# Altium project SysP18_Team10.PrjPcb
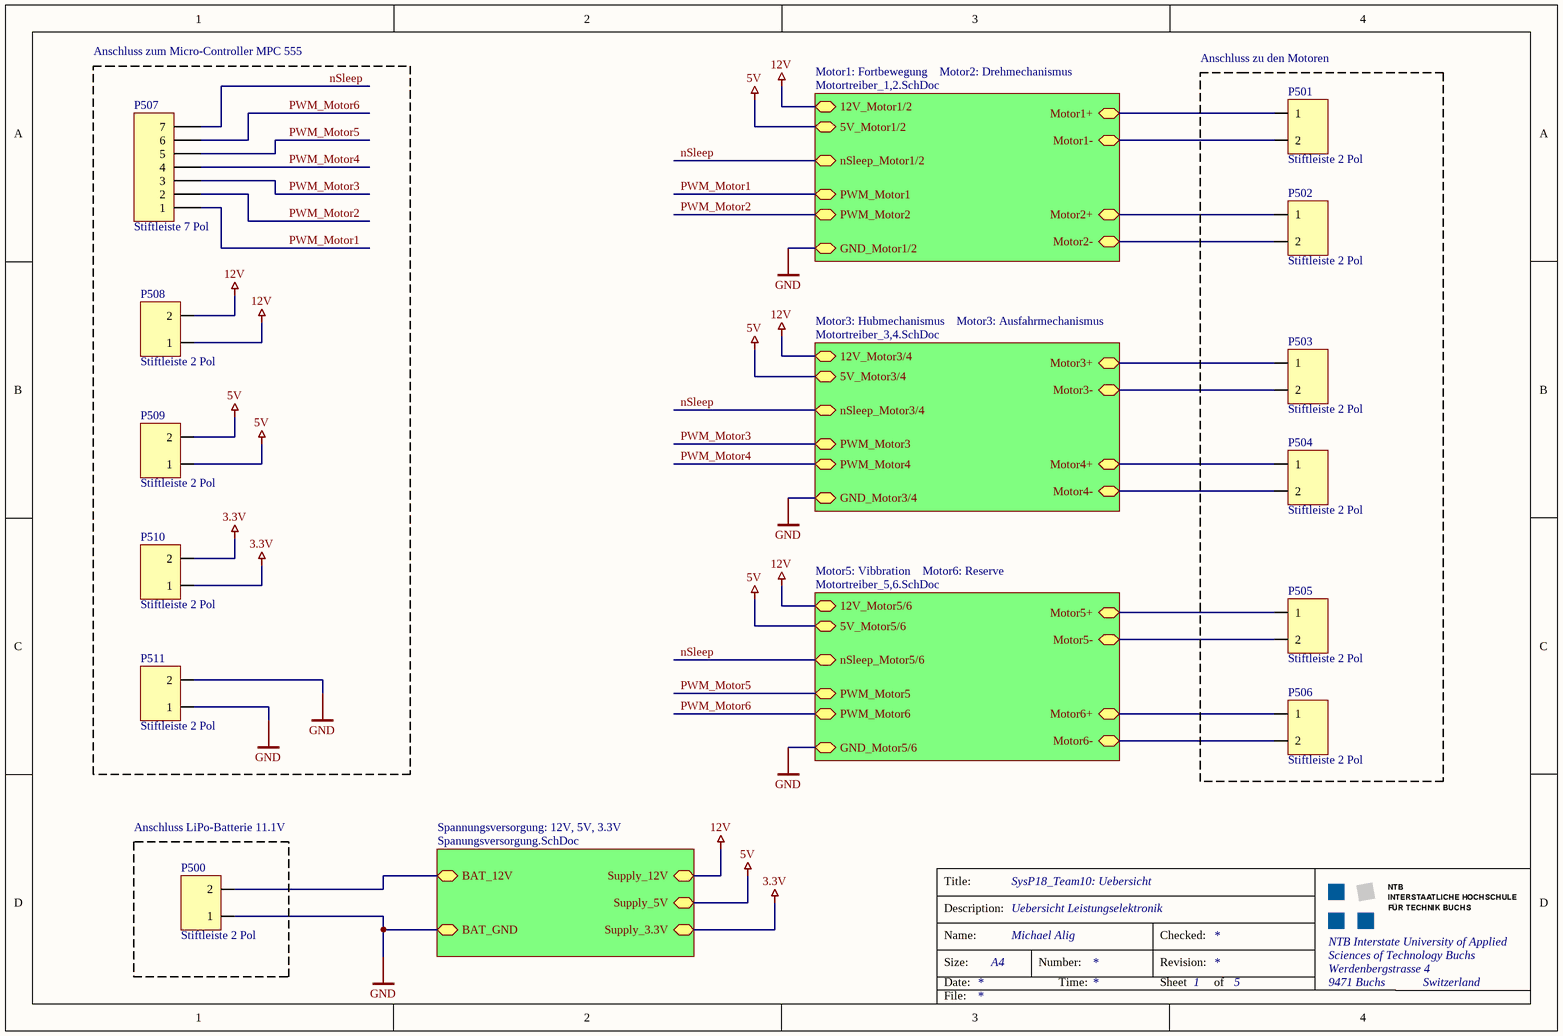
[diagram p0: Uebersicht.SchDoc]
3 sheets, 43 parts. Net scope: hierarchical (ports join the sheet entries above them; power ports are global).
Board file: PCB.PcbDoc
Sheets:
  Uebersicht.SchDoc
    Spannungsversorgung: 12V, 5V, 3.3V = Spanungsversorgung.SchDoc
    Motor1: Fortbewegung    Motor2: Drehmechanismus = Motortreiber_1,2.SchDoc

## Sheet Uebersicht.SchDoc: SysP18_Team10: Uebersicht
size A4; Author: Michael Alig; CompanyName: NTB; Organization: NTB Interstate University of Applied; Address1: Werdenbergstrasse 4; Address3: 9471 Buchs; Address4: Switzerland; SheetNumber: 1; SheetTotal: 5; Organization1: Sciences of Technology Buchs; Size: A4; ShortDescription: Uebersicht Leistungselektronik

### Parts
P500  Stiftleiste 2 Pol  [2Pin Header 2.54mm]
P501  Stiftleiste 2 Pol  [2Pin Header 2.54mm]
P502  Stiftleiste 2 Pol  [2Pin Header 2.54mm]
P503  Stiftleiste 2 Pol  [2Pin Header 2.54mm]
P504  Stiftleiste 2 Pol  [2Pin Header 2.54mm]
P505  Stiftleiste 2 Pol  [2Pin Header 2.54mm]
P506  Stiftleiste 2 Pol  [2Pin Header 2.54mm]
P507  Stiftleiste 7 Pol  [GEN_HEADER-2.54mm_7_H]
P508  Stiftleiste 2 Pol  [2Pin Header 2.54mm]
P509  Stiftleiste 2 Pol  [2Pin Header 2.54mm]
P510  Stiftleiste 2 Pol  [2Pin Header 2.54mm]
P511  Stiftleiste 2 Pol  [2Pin Header 2.54mm]

### Blocks framed on the sheet
Anschluss zum Micro-Controller MPC 555: P507-P511
Anschluss zu den Motoren: P501-P506
Anschluss LiPo-Batterie 11.1V: P500

### Sub-sheets
Motor1: Fortbewegung    Motor2: Drehmechanismus = Motortreiber_1,2.SchDoc: nSleep_Motor1/2, PWM_Motor2, Motor1+, Motor1-, PWM_Motor1, Motor2+, Motor2-, 12V_Motor1/2, GND_Motor1/2, 5V_Motor1/2
Motor3: Hubmechanismus    Motor3: Ausfahrmechanismus = Motortreiber_3,4.SchDoc (file not in this document): nSleep_Motor3/4, PWM_Motor4, Motor3+, Motor3-, PWM_Motor3, Motor4+, Motor4-, 12V_Motor3/4, GND_Motor3/4, 5V_Motor3/4
Motor5: Vibbration    Motor6: Reserve = Motortreiber_5,6.SchDoc (file not in this document): nSleep_Motor5/6, PWM_Motor6, Motor5+, Motor5-, PWM_Motor5, Motor6+, Motor6-, 12V_Motor5/6, GND_Motor5/6, 5V_Motor5/6
Spannungsversorgung: 12V, 5V, 3.3V = Spanungsversorgung.SchDoc: BAT_12V, BAT_GND, Supply_5V, Supply_3.3V, Supply_12V

### Nets
3.3V: P510.1 P510.2 ; sheet Spannungsversorgung: 12V, 5V, 3.3V/Supply_3.3V
5V: P509.1 P509.2 ; sheet Spannungsversorgung: 12V, 5V, 3.3V/Supply_5V, sheet Motor1: Fortbewegung    Motor2: Drehmechanismus/5V_Motor1/2, sheet Motor3: Hubmechanismus    Motor3: Ausfahrmechanismus/5V_Motor3/4, sheet Motor5: Vibbration    Motor6: Reserve/5V_Motor5/6
12V: P508.1 P508.2 ; sheet Spannungsversorgung: 12V, 5V, 3.3V/Supply_12V, sheet Motor1: Fortbewegung    Motor2: Drehmechanismus/12V_Motor1/2, sheet Motor3: Hubmechanismus    Motor3: Ausfahrmechanismus/12V_Motor3/4, sheet Motor5: Vibbration    Motor6: Reserve/12V_Motor5/6
GND: P500.1 P511.1 P511.2 ; sheet Spannungsversorgung: 12V, 5V, 3.3V/BAT_GND, sheet Motor1: Fortbewegung    Motor2: Drehmechanismus/GND_Motor1/2, sheet Motor3: Hubmechanismus    Motor3: Ausfahrmechanismus/GND_Motor3/4, sheet Motor5: Vibbration    Motor6: Reserve/GND_Motor5/6
nSleep: P507.7 ; sheet Motor1: Fortbewegung    Motor2: Drehmechanismus/nSleep_Motor1/2, sheet Motor3: Hubmechanismus    Motor3: Ausfahrmechanismus/nSleep_Motor3/4, sheet Motor5: Vibbration    Motor6: Reserve/nSleep_Motor5/6
PWM_Motor1: P507.1 ; sheet Motor1: Fortbewegung    Motor2: Drehmechanismus/PWM_Motor1
PWM_Motor2: P507.2 ; sheet Motor1: Fortbewegung    Motor2: Drehmechanismus/PWM_Motor2
PWM_Motor3: P507.3 ; sheet Motor3: Hubmechanismus    Motor3: Ausfahrmechanismus/PWM_Motor3
PWM_Motor4: P507.4 ; sheet Motor3: Hubmechanismus    Motor3: Ausfahrmechanismus/PWM_Motor4
PWM_Motor5: P507.5 ; sheet Motor5: Vibbration    Motor6: Reserve/PWM_Motor5
PWM_Motor6: P507.6 ; sheet Motor5: Vibbration    Motor6: Reserve/PWM_Motor6
NetD100_2: P500.2 ; sheet Spannungsversorgung: 12V, 5V, 3.3V/BAT_12V
NetP501_1: P501.1 ; sheet Motor1: Fortbewegung    Motor2: Drehmechanismus/Motor1+
NetP501_2: P501.2 ; sheet Motor1: Fortbewegung    Motor2: Drehmechanismus/Motor1-
NetP502_1: P502.1 ; sheet Motor1: Fortbewegung    Motor2: Drehmechanismus/Motor2+
NetP502_2: P502.2 ; sheet Motor1: Fortbewegung    Motor2: Drehmechanismus/Motor2-
NetP503_1: P503.1 ; sheet Motor3: Hubmechanismus    Motor3: Ausfahrmechanismus/Motor3+
NetP503_2: P503.2 ; sheet Motor3: Hubmechanismus    Motor3: Ausfahrmechanismus/Motor3-
NetP504_1: P504.1 ; sheet Motor3: Hubmechanismus    Motor3: Ausfahrmechanismus/Motor4+
NetP504_2: P504.2 ; sheet Motor3: Hubmechanismus    Motor3: Ausfahrmechanismus/Motor4-
NetP505_1: P505.1 ; sheet Motor5: Vibbration    Motor6: Reserve/Motor5+
NetP505_2: P505.2 ; sheet Motor5: Vibbration    Motor6: Reserve/Motor5-
NetP506_1: P506.1 ; sheet Motor5: Vibbration    Motor6: Reserve/Motor6+
NetP506_2: P506.2 ; sheet Motor5: Vibbration    Motor6: Reserve/Motor6-

### Notes on the sheet
- Title:
- Description:
- Size:
- Date:
- Name:
- Number:
- Time:
- Revision:
- Sheet
- Checked:
- of
- File:

### Library data of the parts
P500-P506 P508-P511 = 2 Pin Connector: 2 Pin Header 2.54mm
P507 = GEN_HEADER_7: generic Header, 7-Pin; Manufacturer: tbd; #Class: CONNECTOR; Publisher: Altium Limited; #ClassSub: HEADER; ComponentLink1Description: Manufacturer Link; ComponentLink2Description: Datasheet; ComponentLink3Description: Packaging Specification; Distributor: tbd; RefFootprint: GEN_HEADER-2.54mm_7_H; Manufacturer PartNr: tbd; Distributor PartNr: tbd; Published: 20121218; RefFileFOO: *; RefFileSCH: *; RefSchema: GEN_HEADER_7

## Sheet Spanungsversorgung.SchDoc: SysP18_Team10: Spannungsregler
size A4; Author: Michael Alig; CompanyName: NTB; Organization: NTB Interstate University of Applied; Address1: Werdenbergstrasse 4; Address3: 9471 Buchs; Address4: Switzerland; SheetNumber: 2; SheetTotal: 5; Organization1: Sciences of Technology Buchs; Size: A4; ShortDescription: Schema Spannungsregler 3.3V, 5V, 12V
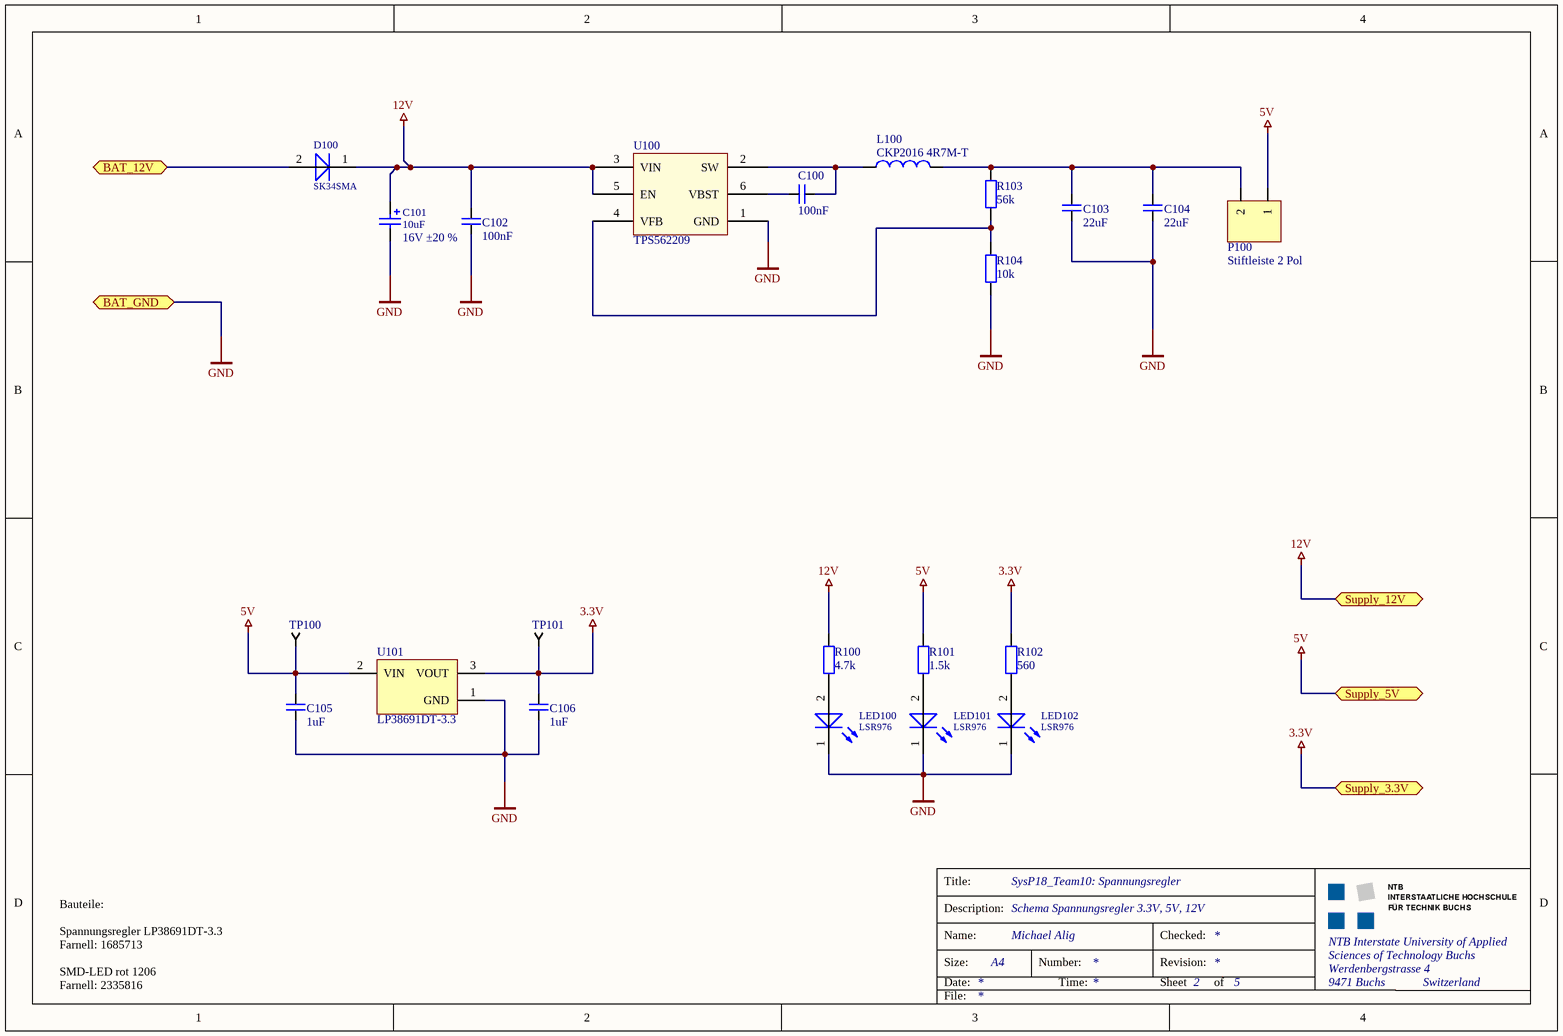
[diagram p1: Spanungsversorgung.SchDoc]

### Parts
C100  100nF  [CAPC0805]
C101  value 10uF  ValueAddon: 16V ±20 %  [CDE_CAP AVE CODE D_H]  (hidden comment: AVE476M16D16T-F)
C102  100nF  [CAPC0805]
C103  22uF  [CAPC1206]
C104  22uF  [CAPC1206]
C105  1uF  [CAPC0805]
C106  1uF  [CAPC0805]
D100  SK34SMA  [DIOTEC_DO-214AC_1K2A_2_H]
L100  CKP2016 4R7M-T  [IND0806]
LED100  LSR976  [CAPC1206]
LED101  LSR976  [CAPC1206]
LED102  LSR976  [CAPC1206]
P100  Stiftleiste 2 Pol  [2Pin Header 2.54mm]
R100  value 4.7k  [GEN_R0805_H]  (hidden comment: Generic)
R101  value 1.5k  [GEN_R0805_H]  (hidden comment: Generic)
R102  value 560  [GEN_R0805_H]  (hidden comment: Generic)
R103  value 56k  [GEN_R0805_H]  (hidden comment: Generic)
R104  value 10k  [GEN_R0805_H]  (hidden comment: Generic)
TP100  Testpoint xSmall  [TP_SMD_xsmall]  (value not drawn)  (no BOM)
TP101  Testpoint xSmall  [TP_SMD_xsmall]  (value not drawn)  (no BOM)
U100  TPS562209  [SOT23-6]
U101  LP38691DT-3.3  [TO-92-TO3]

### Ports
BAT_12V, BAT_GND, Supply_3.3V, Supply_5V, Supply_12V

### Nets
3.3V: C106.1 R102.2 TP101.1 U101.3(VOUT) ; port Supply_3.3V
5V: C105.1 P100.1 R101.2 TP100.1 U101.2(VIN) ; port Supply_5V
12V: C101.1(Pos) C102.1 D100.1(K) R100.2 U100.3(VIN) U100.5(EN) ; port Supply_12V
GND: C101.2(Neg) C102.2 C103.1 C104.2 C105.2 C106.2 LED100.1(K) LED101.1(K) LED102.1(K) R104.1 U100.1(GND) U101.1(GND) ; port BAT_GND
NetC100_1: C100.1 U100.6(VBST)
NetC100_2: C100.2 L100.1 U100.2(SW)
NetC103_2: C103.2 C104.1 L100.2 P100.2 R103.2
NetD100_2: D100.2(A) ; port BAT_12V
NetLED100_2: LED100.2(A) R100.1
NetLED101_2: LED101.2(A) R101.1
NetLED102_2: LED102.2(A) R102.1
NetR103_1: R103.1 R104.2 U100.4(VFB)

### Notes on the sheet
- Bauteile:
  Spannungsregler LP38691DT-3.3
  Farnell: 1685713
  SMD-LED rot 1206
  Farnell: 2335816
- Title:
- Description:
- Size:
- Date:
- Name:
- Number:
- Time:
- Revision:
- Sheet
- Checked:
- of
- File:

### Library data of the parts
C100 C102 C105 C106 = C Bipolar 0805: X7R MLCC 0805 (2012 Metric); Rated Voltage: 50V; Value: 100n; Tolerance: 10%; Case-EIA: 0805; Case-Metric: 2012; Temperature Characteristics EIA: X7R; Temperature Range EIA: -55C/+125C
C101 = CDE_AVE476M16D16T-F_AVE CODE D: Aluminum Electrolytic Capacitors for Filtering and Bypass, 47uF, 16V; Manufacturer: Cornell Dubilier; #Class: PASSIVE; RefFootprint: CDE_CAP AVE CODE D; #ClassSub: CAPACITOR; Distributor PartNr: 598-AVE476M16D16T-F; Distributor: Mouser; Published: 20121220; Publisher: Stefan Ursella, M.Eng; ComponentLink1Description: Manufacturer Link; ComponentLink2Description: Datasheet; ComponentLink2URL: http://www.cde.com/catalogs/AVE.pdf; ComponentLink3Description: Packaging Specification; Manufacturer PartNr: AVE476M16D16T-F; RefFileFOO: *; RefFileSCH: *; RefSchema: CDE_AVE476M16D16T-F_AVE CODE D
C103 C104 = C Bipolar 1206: X7R MLCC 1206 (3016 Metric); Rated Voltage: 10V; Value: 22u; Tolerance: 10%; Case-EIA: 1206; Case-Metric: 3216; Temperature Characteristics EIA: X7R; Temperature Range EIA: -55C/+125C
D100 = DIOTEC_SK34SMA_DO-214AC: Manufacturer: Diotec Semiconductor; #Class: DIODE; #ClassSub: SCHOTTKY; ComponentLink1Description: Manufacturer Link; ComponentLink1URL: http://diotec.com/en/products/all-products/productlist.html?aid=SK34SMA; ComponentLink2Description: Datasheet; ComponentLink2URL: http://diotec.com/tl_files/diotec/files/pdf/datasheets/sk32sma.pdf; ComponentLink3Description: Packaging Specification; ComponentLink3URL: http://diotec.com/en/products/all-products/productlist.html?aid=SK34SMA; Distributor: Distrelec; RefFootprint: DIOTEC_DO-214AC_1K2A_2_H; Manufacturer PartNr: SK34SMA; Distributor PartNr: 600727; Published: 20121217; Publisher: Stefan Ursella, M.Eng; Status: nLager; RefFileFOO: *; RefFileSCH: *; RefSchema: DIOTEC_SK34SMA_DO-214AC
L100 = L: MULTILAYER CHIP POWER INDUCTORS; Manufactor: Taiyo Yuden; Current Rating: 900mA; DCR: 160mOhm; Inductance: 4u7; ComponentLink1Description: Datasheet Taiyo Yuden CK Series; ComponentLink1URL: V:\Inductor\Taiyo_Yuden_CK_Series.pdf
LED100-LED102 = OSR_LSR976_0805(1K2A): Hyper ChipLED, Red,; Manufacturer: OSRAM; #Class: DIODE; #ClassSub: LED; RefFootprint: GEN_LED0805_1K2A_2_H; ComponentLink1Description: Manufacturer Link; ComponentLink1URL: http://www.osram-os.com/osram_os/en/products/product-catalog/led-light-emitting-diodes/chipled/chipled-0805/ls-r976/index.jsp?search_result=%2fosram_os%2fen%2fsearch%2fadvanced_search.jsp%3faction%3ddosearch%26inp_searchterm_1%3dLS%2bR976%26website_name%3dosram_os_en; ComponentLink2Description: Datasheet; ComponentLink2URL: http://catalog.osram-os.com/catalogue/catalogue.do;jsessionid=8A0FA5146E77D3A917A5A5D383CD44B4?act=downloadFile&favOid=0200000600039319000100b6; ComponentLink3Description: Packaging Specification; ComponentLink3URL: http://catalog.osram-os.com/catalogue/catalogue.do;jsessionid=8A0FA5146E77D3A917A5A5D383CD44B4?act=downloadFile&favOid=0200000600039319000100b6; Distributor: Farnell; Manufacturer PartNr: LSR976; Distributor PartNr: 1226392; Published: 20121218; Publisher: Stefan Ursella, M.Eng; RefFileFOO: *; RefFileSCH: *; RefSchema: OSR_LSR976_0805(1K2A)
P100 = 2 Pin Connector
R100-R104 = GEN_R_2: generic resistor; Manufacturer: Tbd; #Class: PASSIVE; Published: 8-Jun-2000; Publisher: Altium Limited; #ClassSub: RESISTOR; ComponentLink1Description: Manufacturer Link; ComponentLink2Description: Datasheet; ComponentLink3Description: Packaging Specification; Distributor: tbd; RefFootprint: GEN_R0805_H; Manufacturer PartNr: tbd; Distributor PartNr: tbd; RefFileFOO: *; RefFileSCH: *; RefSchema: GEN_R_2
TP100 TP101 = Testpoint small: Type: Standard (No BOM)
U100 = TPS562209: 3-A Synchronous Step-Down Voltage Regulator; Manufactor: Texas Instruments; Order Nr.: TPS562209DDCR; ComponentLink1Description: Datasheet TPS56x209; ComponentLink1URL: V:\Power_Management_ICs\PWM_Cont\TPS56x209.pdf
U101 = MCP1700-1202E/TO: Low Quiescent Current LDO, 3-Pin TO-92, Extended TemperatureBAG; Published: 29-Jan-2009; DatasheetVersion: revB, Feb-2007; PackageVersion: revBB, Aug-2009; PackageReference: TO-92-TO3; Publisher: Altium Limited; PackageDescription: 3-Lead Plastic Transistor Outline (TO) [TO-92]; Supplier 1: Digi-Key; Supplier Part Number 1: MCP1700-1202E/TO-ND; ComponentLink1Description: Datasheet; ComponentLink1URL: http://ww1.microchip.com/downloads/en/DeviceDoc/21826b.pdf; ComponentLink2Description: Packaging Specification; ComponentLink2URL: http://www.microchip.com/stellent/groups/techpub_sg/documents/packagingspec/en012702.pdf; ComponentLink3Description: Microchip.com Home; ComponentLink3URL: http://www.microchip.com/

## Sheet Motortreiber_1,2.SchDoc: SysP18_Team10: Motortreiber 1/2
size A4; Author: Michael Alig; CompanyName: NTB; Organization: NTB Interstate University of Applied; Address1: Werdenbergstrasse 4; Address3: 9471 Buchs; Address4: Switzerland; SheetNumber: 3; SheetTotal: 5; Organization1: Sciences of Technology Buchs; Size: A4; ShortDescription: Motortreiber Motor1, Motor2
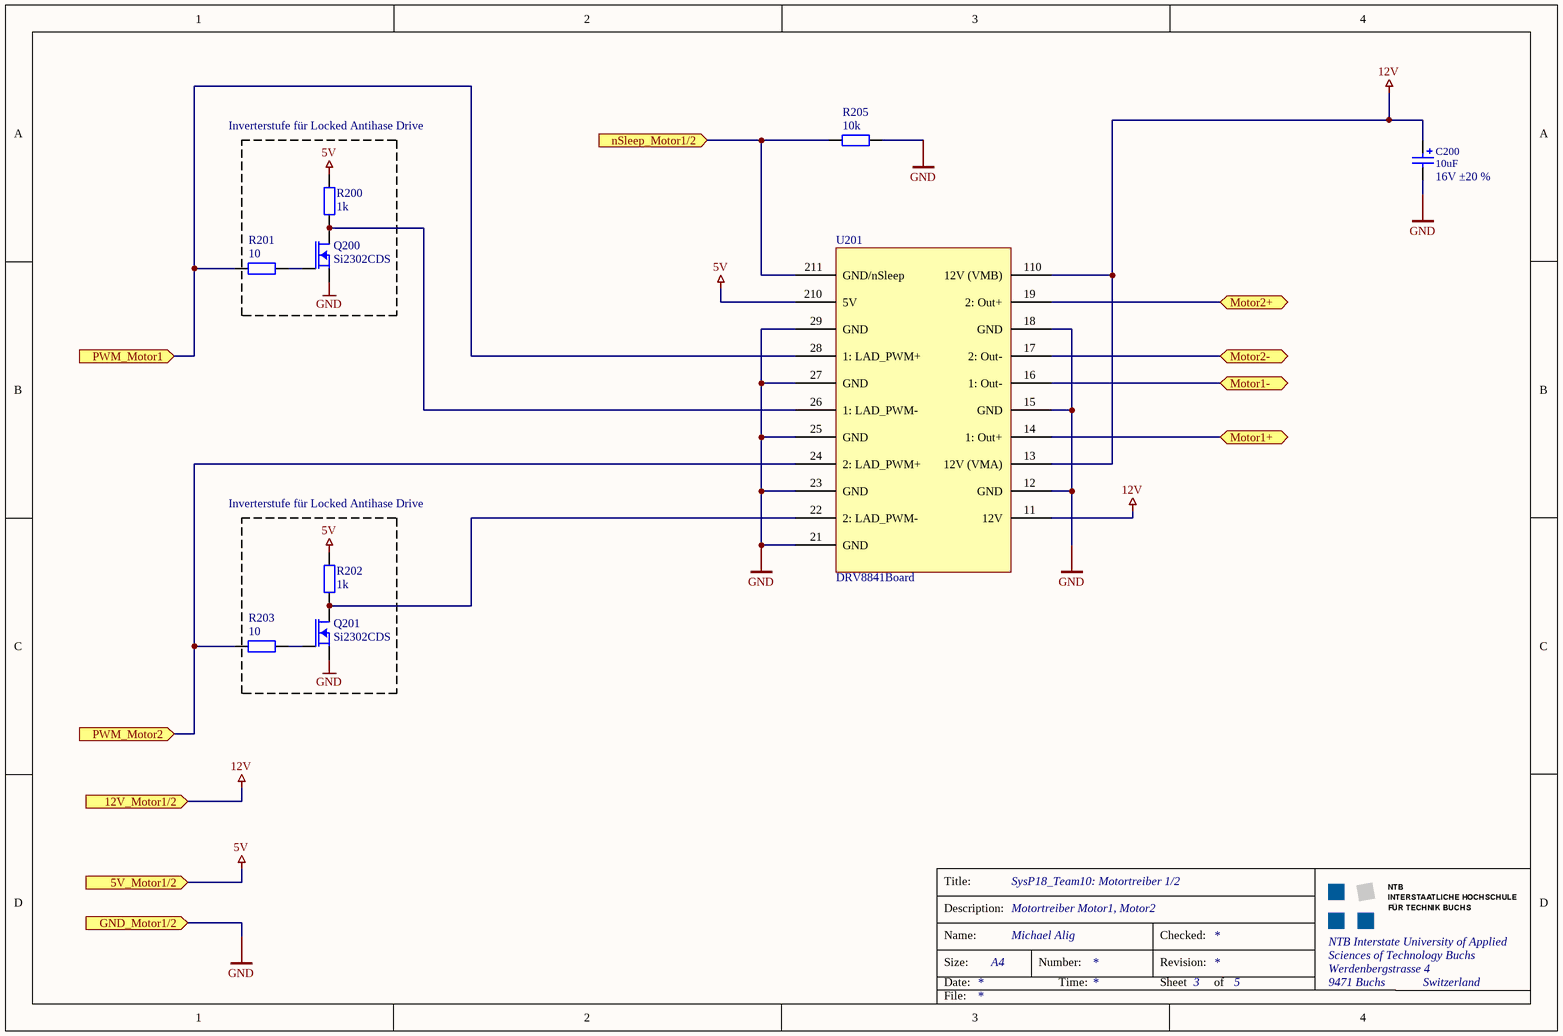
[diagram p2: Motortreiber_1,2.SchDoc]

### Parts
C200  value 10uF  ValueAddon: 16V ±20 %  [CDE_CAP AVE CODE D_H]  (hidden comment: AVE476M16D16T-F)
Q200  Si2302CDS  [SOT23-3]
Q201  Si2302CDS  [SOT23-3]
R200  value 1k  [GEN_R0805_H]  (hidden comment: Generic)
R201  value 10  [GEN_R0805_H]  (hidden comment: Generic)
R202  value 1k  [GEN_R0805_H]  (hidden comment: Generic)
R203  value 10  [GEN_R0805_H]  (hidden comment: Generic)
R205  value 10k  [GEN_R0805_H]  (hidden comment: Generic)
U201  DRV8841Board  [DRV8841_Board]

### Ports
5V_Motor1/2 (in), 12V_Motor1/2 (in), GND_Motor1/2 (in), Motor1+, Motor1-, Motor2+, Motor2-, nSleep_Motor1/2 (in), PWM_Motor1 (in), PWM_Motor2 (in)

### Nets
5V: R200.2 R202.2 U201.210(5V) ; port 5V_Motor1/2
12V: C200.1(Pos) U201.11(12V) U201.13(12V_(VMA)) U201.110(12V_(VMB)) ; port 12V_Motor1/2
GND: C200.2(Neg) Q200.2(S) Q201.2(S) R205.2 U201.12(GND) U201.15(GND) U201.18(GND) U201.21(GND) U201.23(GND) U201.25(GND) U201.27(GND) U201.29(GND) ; port GND_Motor1/2
nSleep: R205.1 U201.211(GND/nSleep) ; port nSleep_Motor1/2
PWM_Motor1: R201.1 U201.28(1:_LAD_PWM+) ; port PWM_Motor1
PWM_Motor2: R203.1 U201.24(2:_LAD_PWM+) ; port PWM_Motor2
NetP501_1: U201.14(1:_Out+) ; port Motor1+
NetP501_2: U201.16(1:_Out-) ; port Motor1-
NetP502_1: U201.19(2:_Out+) ; port Motor2+
NetP502_2: U201.17(2:_Out-) ; port Motor2-
NetQ200_1: Q200.1(G) R201.2
NetQ200_3: Q200.3(D) R200.1 U201.26(1:_LAD_PWM-)
NetQ201_1: Q201.1(G) R203.2
NetQ201_3: Q201.3(D) R202.1 U201.22(2:_LAD_PWM-)

### Notes on the sheet
- Inverterstufe für Locked Antihase Drive
- Title:
- Description:
- Size:
- Date:
- Name:
- Number:
- Time:
- Revision:
- Sheet
- Checked:
- of
- File:

### Library data of the parts
C200 = CDE_AVE476M16D16T-F_AVE CODE D: as C101 on sheet Spanungsversorgung; #ClassSub: CAPACITOR; Distributor PartNr: 598-AVE476M16D16T-F; Distributor: Mouser; Published: 20121220; Publisher: Stefan Ursella, M.Eng; ComponentLink1Description: Manufacturer Link; ComponentLink2Description: Datasheet; ComponentLink2URL: http://www.cde.com/catalogs/AVE.pdf; ComponentLink3Description: Packaging Specification; Manufacturer PartNr: AVE476M16D16T-F; RefFileFOO: *; RefFileSCH: *; RefSchema: CDE_AVE476M16D16T-F_AVE CODE D
Q200 Q201 = Depletion Mode MOSFET: N-Channel 20V (D-S) MOSFET; ID: 2.9A; RDSON: 57mR; VDSS: 20V; ComponentLink1Description: Datasheet Si2302CDS; ComponentLink1URL: V:\MosFets\si2302cds.pdf
R200-R203 R205 = GEN_R_2: as R100 on sheet Spanungsversorgung; Published: 8-Jun-2000; Publisher: Altium Limited; #ClassSub: RESISTOR; ComponentLink1Description: Manufacturer Link; ComponentLink2Description: Datasheet; ComponentLink3Description: Packaging Specification; Distributor: tbd; RefFootprint: GEN_R0805_H; Manufacturer PartNr: tbd; Distributor PartNr: tbd; RefFileFOO: *; RefFileSCH: *; RefSchema: GEN_R_2
U201 = DRV8841_Board

## Nets that join several sheets
3.3V: Uebersicht (P510.1 P510.2), Spanungsversorgung (C106.1 R102.2 TP101.1 U101.3)
5V: Uebersicht (P509.1 P509.2), Spanungsversorgung (5 pins), Motortreiber_1,2 (R200.2 R202.2 U201.210)
12V: Uebersicht (P508.1 P508.2), Spanungsversorgung (6 pins), Motortreiber_1,2 (C200.1 U201.11 U201.13 U201.110)
GND: Uebersicht (P500.1 P511.1 P511.2), Spanungsversorgung (12 pins), Motortreiber_1,2 (12 pins)
NetD100_2: Uebersicht (P500.2), Spanungsversorgung (D100.2)
NetP501_1: Uebersicht (P501.1), Motortreiber_1,2 (U201.14)
NetP501_2: Uebersicht (P501.2), Motortreiber_1,2 (U201.16)
NetP502_1: Uebersicht (P502.1), Motortreiber_1,2 (U201.19)
NetP502_2: Uebersicht (P502.2), Motortreiber_1,2 (U201.17)
nSleep: Uebersicht (P507.7), Motortreiber_1,2 (R205.1 U201.211)
PWM_Motor1: Uebersicht (P507.1), Motortreiber_1,2 (R201.1 U201.28)
PWM_Motor2: Uebersicht (P507.2), Motortreiber_1,2 (R203.1 U201.24)